# Altium schematic sheet target.SchDoc
size A
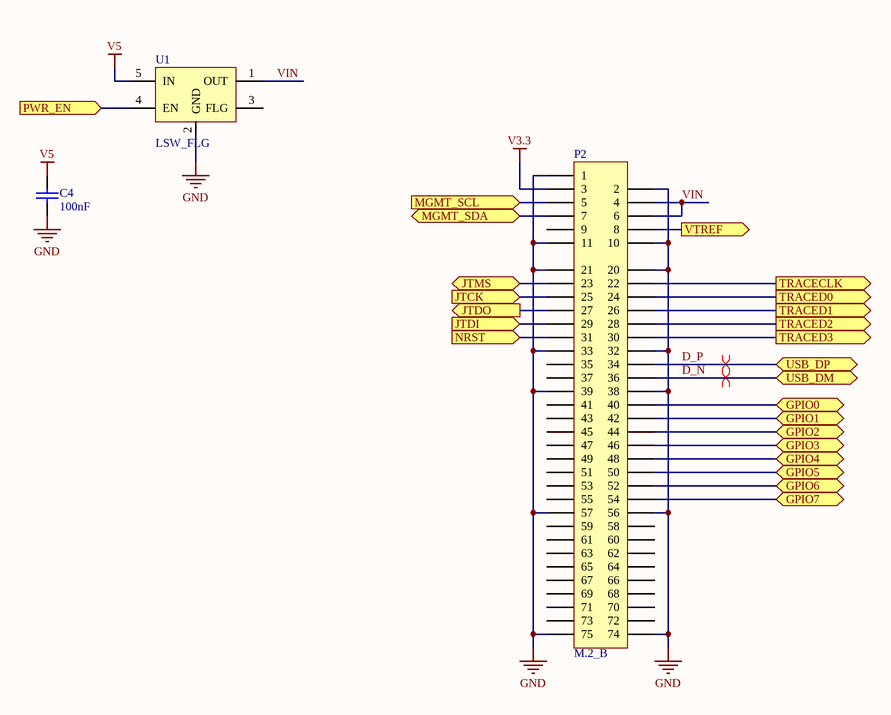
[diagram p0: target.SchDoc]

## Parts
C4  100nF  [0402]
P2  M.2_B  [M.2_B]
U1  LSW_FLG  [SOT23-5]

## Ports
GPIO0 (bidir), GPIO1 (bidir), GPIO2 (bidir), GPIO3 (bidir), GPIO4 (bidir), GPIO5 (bidir), GPIO6 (bidir), GPIO7 (bidir), JTCK (in), JTDI (in), JTDO (out), JTMS (bidir), MGMT_SCL (in), MGMT_SDA (bidir), NRST (in), PWR_EN (in), TRACECLK (out), TRACED0 (out), TRACED1 (out), TRACED2 (out), TRACED3 (out), USB_DM (bidir), USB_DP (bidir), VTREF (out)

## Nets
GND: C4.1 P2.1 P2.2 P2.10 P2.11 P2.20 P2.21 P2.32 P2.33 P2.38 P2.39 P2.56 P2.57 P2.74 P2.75 U1.2(GND)
V3.3: P2.3
V5: C4.2 U1.5(IN)
D_N: P2.36 ; port USB_DM
D_P: P2.34 ; port USB_DP
GPIO0: P2.40 ; port GPIO0
GPIO1: P2.42 ; port GPIO1
GPIO2: P2.44 ; port GPIO2
GPIO3: P2.46 ; port GPIO3
GPIO4: P2.48 ; port GPIO4
GPIO5: P2.50 ; port GPIO5
GPIO6: P2.52 ; port GPIO6
GPIO7: P2.54 ; port GPIO7
JTCK: P2.25 ; port JTCK
JTDI: P2.29 ; port JTDI
JTDO: P2.27 ; port JTDO
JTMS: P2.23 ; port JTMS
MGMT_SCL: P2.5 ; port MGMT_SCL
MGMT_SDA: P2.7 ; port MGMT_SDA
NRST: P2.31 ; port NRST
PWR_EN: U1.4(EN) ; port PWR_EN
TRACECLK: P2.22 ; port TRACECLK
TRACED0: P2.24 ; port TRACED0
TRACED1: P2.26 ; port TRACED1
TRACED2: P2.28 ; port TRACED2
TRACED3: P2.30 ; port TRACED3
VIN: P2.4 P2.6 U1.1(OUT)
VTREF: P2.8 ; port VTREF

Not connected (* = marked no-connect by the designer): P2 9 35 37 41 43 45 47 49 51 53 55 58 59 60 61 62 63 64 65 66 67 68 69 70 71 72 73; U1 3(FLG)

## Layout directives
differential pair: D_N, D_P

## Library data of the parts
C4 = Capacitor: Value: 100nF